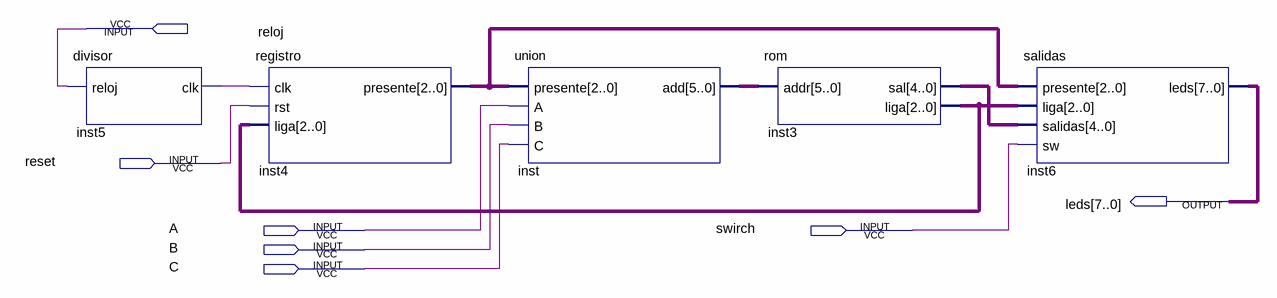
[diagram p0: schematic sheet]
// Quartus schematic dir_trayectoria.bdf as structural Verilog: 5 symbols, 7 pins
module dir_trayectoria (
  input  reloj,
  input  reset,
  input  A,
  input  swirch,
  input  B,
  input  C,
  output [7:0] leds
);

  wire inst5_clk;
  wire [2:0] inst3_liga, inst4_presente;
  wire [4:0] inst3_sal;
  wire [5:0] inst_add;

  divisor inst5 (.reloj(reloj), .clk(inst5_clk));
  registro inst4 (.clk(inst5_clk), .rst(reset), .liga(inst3_liga), .presente(inst4_presente));
  \union  inst (.presente(inst4_presente), .A(A), .B(B), .C(C), .add(inst_add));
  rom inst3 (.addr(inst_add), .sal(inst3_sal), .liga(inst3_liga));
  salidas inst6 (.presente(inst4_presente), .liga(inst3_liga), .salidas(inst3_sal), .sw(swirch), .leds(leds));
endmodule
